# Altium schematic sheet ST_LINK.SchDoc
size A4; SheetNumber: 5; SheetTotal: 7
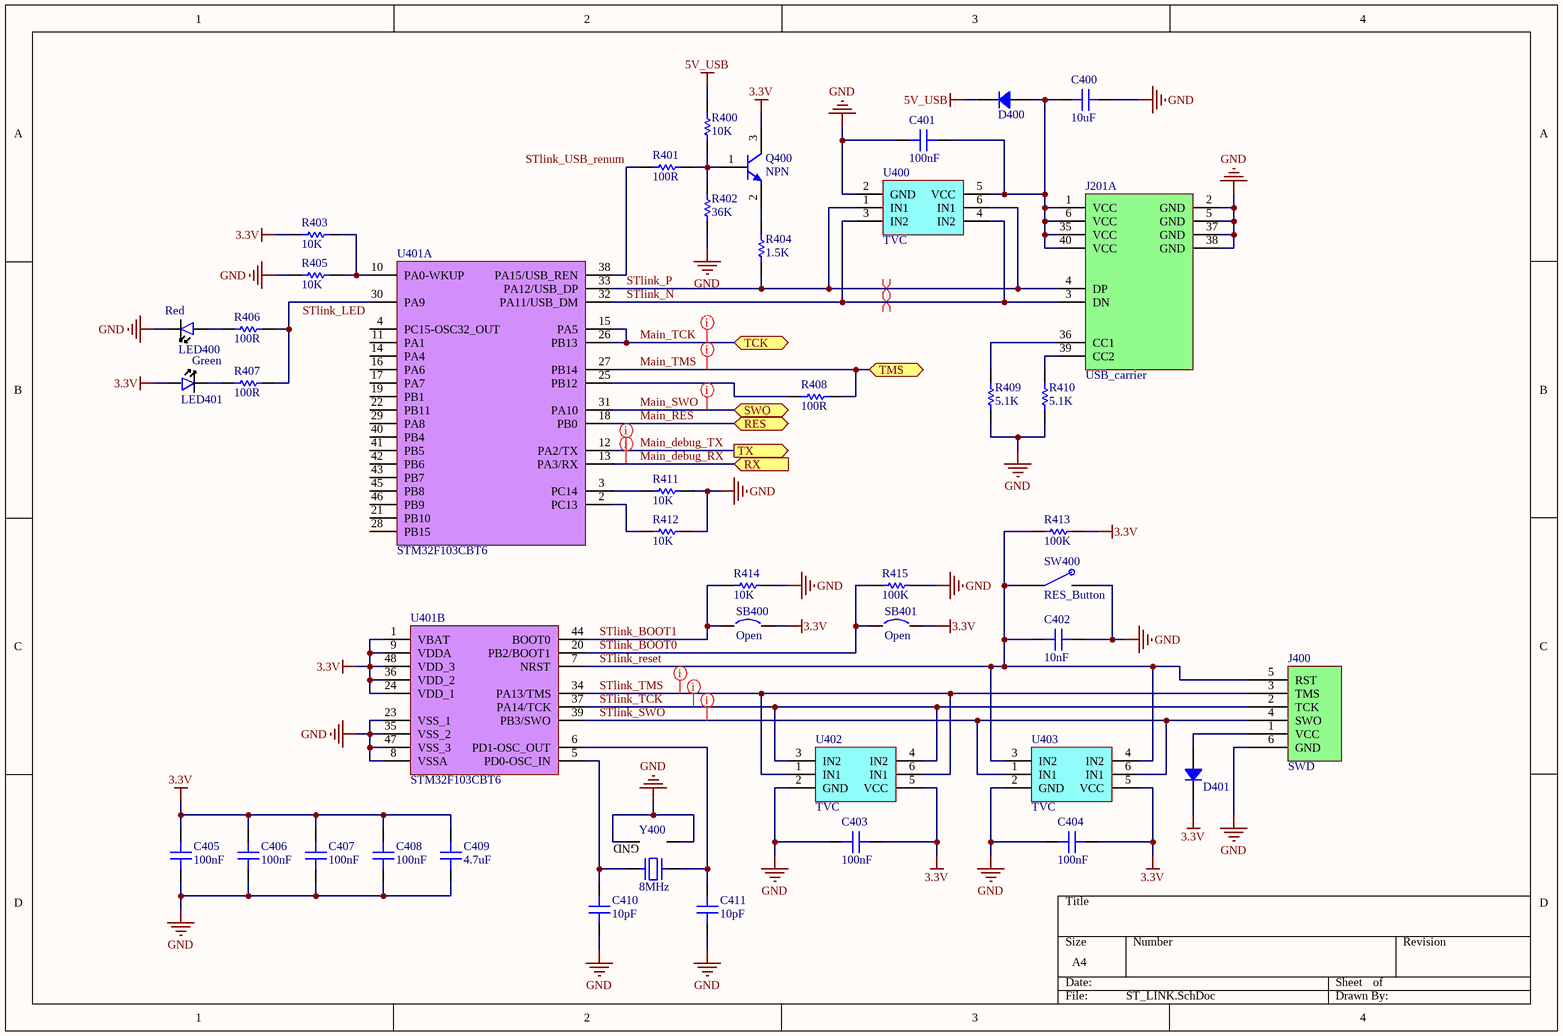
[diagram p0: ST_LINK.SchDoc]

## Parts
C400  10uF  [CAP 0603]
C401  100nF  [CAP 0603]
C402  10nF  [CAP 0603]
C403  100nF  [CAP 0603]
C404  100nF  [CAP 0603]
C405  100nF  [CAP 0603]
C406  100nF  [CAP 0603]
C407  100nF  [CAP 0603]
C408  100nF  [CAP 0603]
C409  4.7uF  [CAP 1206]
C410  10pF  [CAP 0603]
C411  10pF  [CAP 0603]
D400  (no value)  [Bourns DO214AC SMA - duplicate]
D401  (no value)  [Bourns DO214AC SMA - duplicate]
J201  USB_carrier  [2167010409]  (part A of 4)
J400  SWD  [AMPHENOL_20021121-00006C1LF]
LED400  Red  [LED_0603]
LED401  Green  [LED_0603]
Q400  NPN  [SOT-23]
R400  10K  [RES 0603]
R401  100R  [RES 0603]
R402  36K  [RES 0603]
R403  10K  [RES 0603]
R404  1.5K  [RES 0603]
R405  10K  [RES 0603]
R406  100R  [RES 0603]
R407  100R  [RES 0603]
R408  100R  [RES 0603]
R409  5.1K  [RES 0603]
R410  5.1K  [RES 0603]
R411  10K  [RES 0603]
R412  10K  [RES 0603]
R413  100K  [RES 0603]
R414  10K  [RES 0603]
R415  100K  [RES 0603]
SB400  Open  [SB_0603]
SB401  Open  [SB_0603]
SW400  RES_Button  [PTS636SM50JSMTRLFS]
U400  TVC  [DIODES SOT-23-6 W6]
U401  STM32F103CBT6  [TI PQFP-48 PAG0048A]  (parts A,B of 2)
U402  TVC  [SOT95P275X110-6N - duplicate - duplicate]
U403  TVC  [SOT95P275X110-6N - duplicate - duplicate]
Y400  8MHz  [XTAL_ECS-80-10-33-CHN-TR3]

## Ports
RES (bidir, see Main_scheme[1C], Debug_switch[2C]), RX (in, see Main_scheme[1C], Debug_switch[3C]), SWO (bidir, see Main_scheme[1C], Debug_switch[2C]), TCK (bidir, see Main_scheme[1C], Debug_switch[2B]), TMS (bidir, see Main_scheme[1C], Debug_switch[2B]), TX (out, see Main_scheme[1C], Debug_switch[3C])

## Nets
3.3V: C403.1 C404.1 C405.2 C406.2 C407.2 C408.2 C409.2 D401.2 LED401.1(R) Q400.3(C) R403.1 R413.2 SB400.2 SB401.2 U401.1(VBAT) U401.9(VDDA) U401.24(VDD_1) U401.36(VDD_2) U401.48(VDD_3) U402.5(VCC) U403.5(VCC)
5V_USB: D400.2 R400.2
GND: C400.1 C401.1 C402.1 C403.2 C404.2 C405.1 C406.1 C407.1 C408.1 C409.1 C410.1 C411.1 J201.2(GND) J201.5(GND) J201.37(GND) J201.38(GND) J400.6(GND) LED400.2(Catode) R402.1 R405.1 R409.1 R410.1 R411.2 R412.2 R414.2 R415.2 SW400.2 U400.2(GND) U401.8(VSSA) U401.23(VSS_1) U401.35(VSS_2) U401.47(VSS_3) U402.2(GND) U403.2(GND) Y400.2(GND) Y400.4(GND)
Main_debug_RX: U401.13(PA3/RX) ; port RX
Main_debug_TX: U401.12(PA2/TX) ; port TX
Main_RES: U401.18(PB0) ; port RES
Main_SWO: U401.31(PA10) ; port SWO
Main_TCK: U401.15(PA5) U401.26(PB13) ; port TCK
Main_TMS: R408.2 U401.27(PB14) ; port TMS
STlink_BOOT0: R415.1 SB401.1 U401.20(PB2/BOOT1)
STlink_BOOT1: R414.1 SB400.1 U401.44(BOOT0)
STlink_LED: R406.2 R407.2 U401.30(PA9)
STlink_N: J201.3(DN) U400.3(IN2) U400.4(IN2) U401.32(PA11/USB_DM)
STlink_P: J201.4(DP) R404.1 U400.1(IN1) U400.6(IN1) U401.33(PA12/USB_DP)
STlink_reset: C402.2 J400.5(RST) R413.1 SW400.1 U401.7(NRST) U403.3(IN2) U403.4(IN2)
STlink_SWO: J400.4(SWO) U401.39(PB3/SWO) U403.1(IN1) U403.6(IN1)
STlink_TCK: J400.2(TCK) U401.37(PA14/TCK) U402.3(IN2) U402.4(IN2)
STlink_TMS: J400.3(TMS) U401.34(PA13/TMS) U402.1(IN1) U402.6(IN1)
STlink_USB_renum: R401.1 U401.38(PA15/USB_REN)
NetC400_2: C400.2 C401.2 D400.1 J201.1(VCC) J201.6(VCC) J201.35(VCC) J201.40(VCC) U400.5(VCC)
NetC410_2: C410.2 U401.5(PD0-OSC_IN) Y400.1
NetC411_2: C411.2 U401.6(PD1-OSC_OUT) Y400.3
NetD401_1: D401.1 J400.1(VCC)
NetJ201_36: J201.36(CC1) R409.2
NetJ201_39: J201.39(CC2) R410.2
NetLED400_1: LED400.1(R) R406.1
NetLED401_2: LED401.2(Catode) R407.1
NetQ400_1: Q400.1(B) R400.1 R401.2 R402.2
NetQ400_2: Q400.2(E) R404.2
NetR403_2: R403.2 R405.2 U401.10(PA0-WKUP)
NetR408_1: R408.1 U401.25(PB12)
NetR411_1: R411.1 U401.3(PC14)
NetR412_1: R412.1 U401.2(PC13)

Not connected (* = marked no-connect by the designer): U401 4(PC15-OSC32_OUT) 11(PA1) 14(PA4) 16(PA6) 17(PA7) 19(PB1) 21(PB10) 22(PB11) 28(PB15) 29(PA8) 40(PB4) 41(PB5) 42(PB6) 43(PB7) 45(PB8) 46(PB9)

## Layout directives
differential pair: STlink_N, STlink_P
net class STLink_SWD: STlink_SWO, STlink_TCK, STlink_TMS
net class Main_SWD: Main_SWO, Main_TCK, Main_TMS
net class Main_debug_UART: Main_debug_RX, Main_debug_TX

## Library data of the parts
C400-C411 = Capacitor: SMT Capacitor
  C400: Value: 10uF
  C401 C403-C408: Value: 100nF
  C402: Value: 10nF
  C409: Value: 4.7uF
  C410 C411: Value: 10pF
D400 D401 = Diode: Rectifier Diode
J400 = SWD_connector
LED400 LED401 = LED: MFR Part #: NCD1206B1; Type: Extended; LCSC Part#: C130717; Datasheet: https://datasheet.lcsc.com/lcsc/2008201033_Foshan-NationStar-Optoelectronics-NCD1206B1_C130717.pdf
R400-R415 = Res: Resistor; Ordered by: Subcon; Published: 8-Jun-2000; Revision: July-2002: Re-released for DXP Platform.; Publisher: Altium Limited
  R400 R403 R405 R411 R412 R414: Value: 10K
  R401 R406-R408: Value: 100R
  R402: Value: 36K
  R404: Value: 1.5K
  R409 R410: Value: 5.1K
  R413 R415: Value: 100K
SB400 SB401 = Circuit Breaker: Published: 24-Mar-1999; Revision: July-2002: Re-released for DXP Platform.; Publisher: Altium Limited
U400 = USB_TVC_protection
U401 = CMP-0237-00250-3: ARM Cortex-M3 32-bit MCU, 128 KB Flash, 20 KB Internal RAM, 37 I/Os, 48-pin LQFP, -40 to 85 degC, Tray; Supply Voltage(Vcc) min (V): 2; Operating Frequency(F) (Processor speed) (MHz): 72; A/D Converter: 2x12-bit (10 Channel); FLASH Size (Prog) (kB): 128; Internal RAM Size (kB): 20; I/Os (High Current): 37; ComponentLink2Description: Datasheet; PackageReference: LQFP48; PartNumber: STM32F103CBT6; ComponentLink1Description: Manufacturer URL; DatasheetVersion: Rev. 16; PackageVersion: Rev. 6, 06/2013; Packing: Tray; ComponentLink1URL: http://www.st.com/web/en/home.html; Mounting Technology: Surface Mount; ComponentLink3URL: http://www.st.com/st-web-ui/static/active/en/resource/technical/document/datasheet/DM00058181.pdf; PackageDescription: 48-Pin Low Profile Quad Flat Package, 7 x 7 mm Body, 0.5 mm Pitch; Core: ARM Cortex-M3; ComponentLink3Description: Package Specification; ComponentLink2URL: http://www.st.com/st-web-ui/static/active/en/resource/technical/document/datasheet/CD00161566.pdf
U402 U403 = TVC_protection
Y400 = Crystal 8Mhz: SMT Crystal; Value: 8MHz